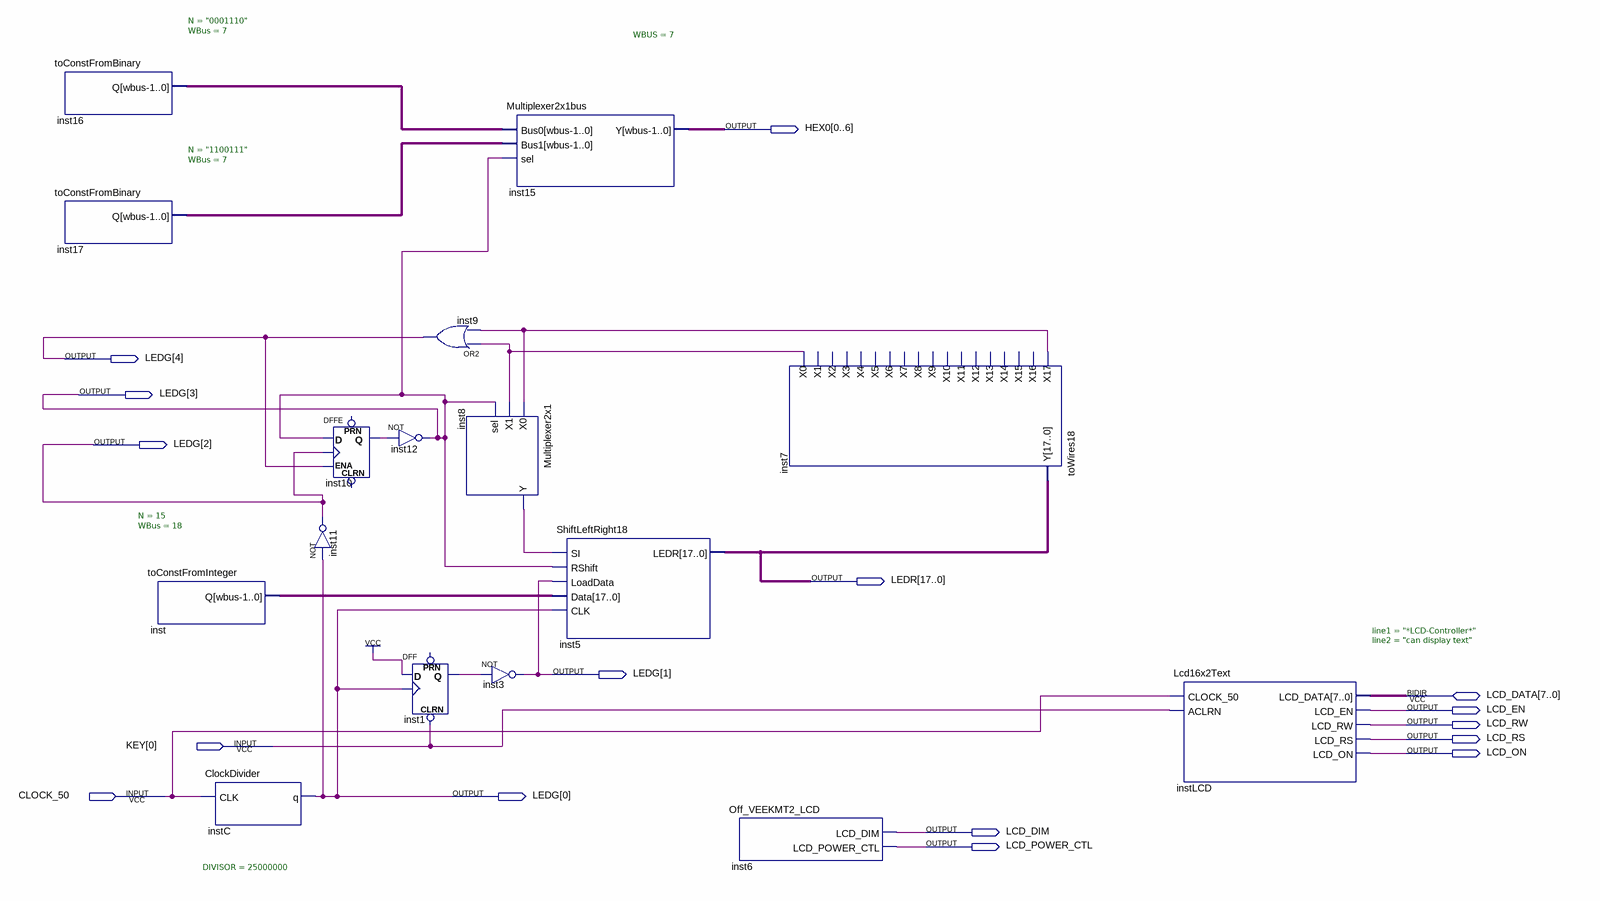
[diagram p0: schematic sheet]
// Quartus schematic SvetelnyHad.bdf as structural Verilog: 16 symbols, 16 pins
module SvetelnyHad (
  input  [0:0] KEY,
  input  CLOCK_50,
  inout  [7:0] LCD_DATA,
  output [0:6] HEX0,
  output [4:0] LEDG,
  output [17:0] LEDR,
  output LCD_EN,
  output LCD_RW,
  output LCD_RS,
  output LCD_ON,
  output LCD_DIM,
  output LCD_POWER_CTL
);

  wire inst1_q, inst7_x0, inst7_x17, inst8_y, inst10_q;
  wire [6:0] inst16_q, inst17_q;
  wire [17:0] inst_q;

  toConstFromBinary #(.N("0001110"), .WBus(7)) inst16 (.Q(inst16_q));
  toConstFromBinary #(.N("1100111"), .WBus(7)) inst17 (.Q(inst17_q));
  toConstFromInteger #(.N(15), .WBus(18)) inst (.Q(inst_q));
  ClockDivider #(.DIVISOR(25000000)) instC (.CLK(CLOCK_50), .q(LEDG[0]));
  DFFE inst10 (.D(LEDG[3]), .CLK(LEDG[2]), .ENA(LEDG[4]), .Q(inst10_q));  // open: PRN, CLRN
  not inst11 (LEDG[2], LEDG[0]);
  not inst12 (LEDG[3], inst10_q);
  DFF inst1 (.CLRN(KEY[0]), .CLK(LEDG[0]), .D(1'b1), .Q(inst1_q));  // open: PRN
  or inst9 (LEDG[4], inst7_x0, inst7_x17);
  Multiplexer2x1 inst8 (.X0(inst7_x17), .X1(inst7_x0), .sel(LEDG[3]), .Y(inst8_y));
  Multiplexer2x1bus #(.WBUS(7)) inst15 (.Bus0(inst16_q), .Bus1(inst17_q), .sel(LEDG[3]), .Y(HEX0));
  not inst3 (LEDG[1], inst1_q);
  ShiftLeftRight18 inst5 (
    .SI(inst8_y), .RShift(LEDG[3]), .LoadData(LEDG[1]), .Data(inst_q), .CLK(LEDG[0]), .LEDR(LEDR));
  Off_VEEKMT2_LCD inst6 (.LCD_DIM(LCD_DIM), .LCD_POWER_CTL(LCD_POWER_CTL));
  toWires18 inst7 (
    .Y(LEDR), .X17(inst7_x17), .X0(inst7_x0));  // open: X16, X15, X14, X13, X12, X11, X10, X9, X8, X7, X6, X5, X4, X3, X2, X1
  Lcd16x2Text #(.line1("*LCD-Controller*"), .line2("can display text")) instLCD (
    .CLOCK_50(CLOCK_50), .ACLRN(KEY[0]), .LCD_EN(LCD_EN), .LCD_RW(LCD_RW), .LCD_RS(LCD_RS), .LCD_ON(LCD_ON),
    .LCD_DATA(LCD_DATA));
endmodule
